# Altium schematic sheet Main.SchDoc: MoonPilot - Main
size A3; DrawnBy: Máni Magnússon; Revision: A; SheetNumber: 1
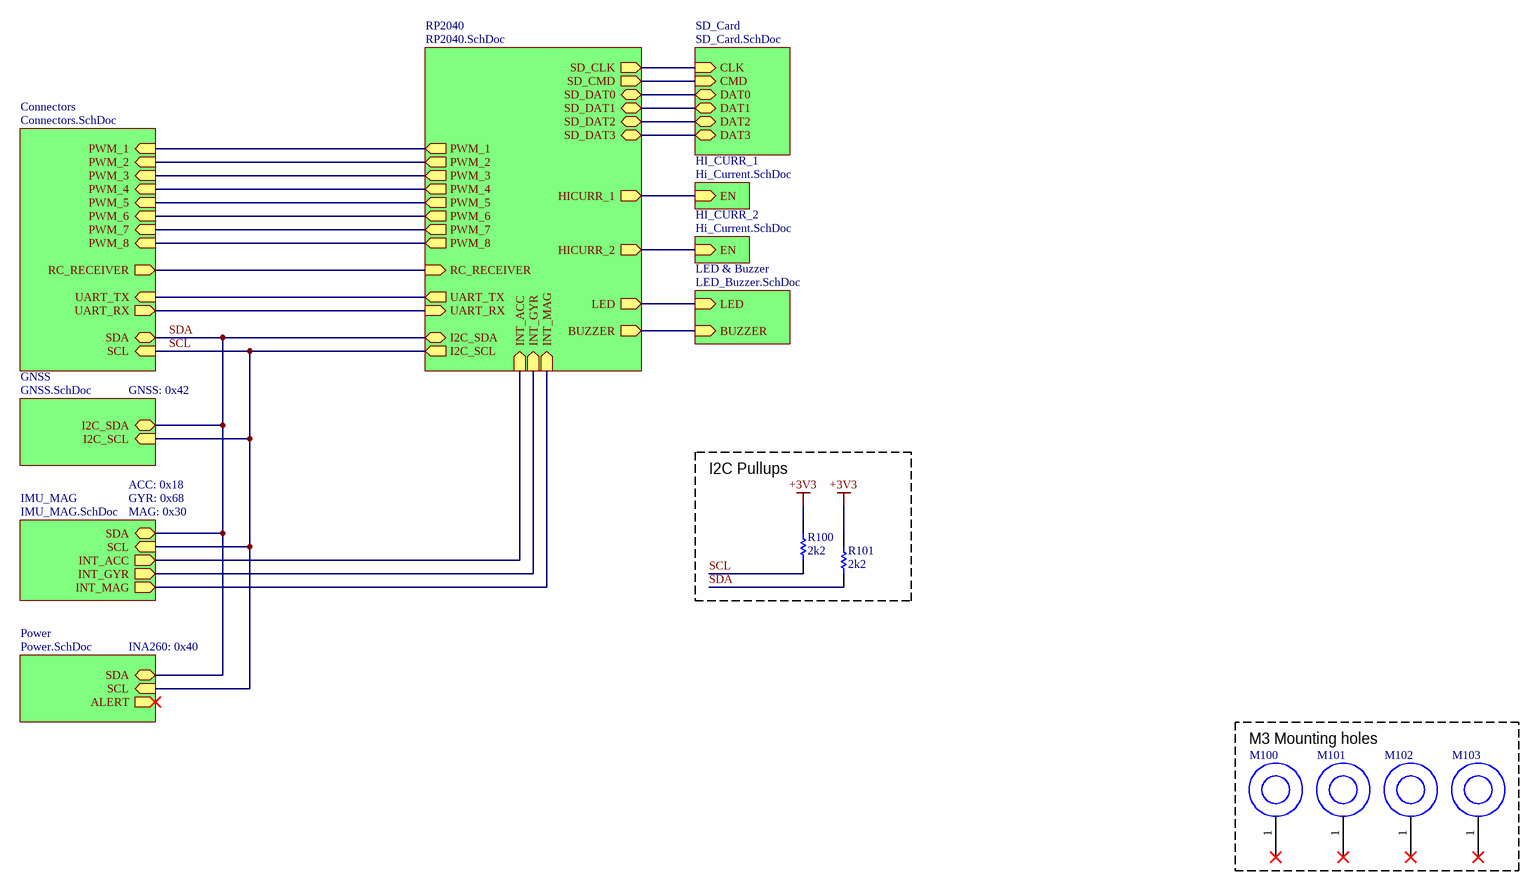
[diagram p0: Main.SchDoc]

## Parts
M100  Mounting Screw  [M3_SCREW]  (value not drawn)
M101  Mounting Screw  [M3_SCREW]  (value not drawn)
M102  Mounting Screw  [M3_SCREW]  (value not drawn)
M103  Mounting Screw  [M3_SCREW]  (value not drawn)
R100  2k2  [0603_RES]
R101  2k2  [0603_RES]

## Blocks framed on the sheet
I2C Pullups: R100 R101
M3 Mounting holes: M100-M103

## Sub-sheets
Connectors = Connectors.SchDoc: PWM_1 (in), PWM_2 (in), PWM_3 (in), PWM_4 (in), PWM_5 (in), PWM_6 (in), PWM_7 (in), PWM_8 (in), SDA (bidir), SCL (in), RC_RECEIVER (out), UART_TX (in), UART_RX (out)
GNSS = GNSS.SchDoc: I2C_SCL (in), I2C_SDA (bidir)
HI_CURR_1 = Hi_Current.SchDoc: EN (in)
HI_CURR_2 = Hi_Current.SchDoc: EN (in)
IMU_MAG = IMU_MAG.SchDoc: SDA (bidir), SCL (in), INT_ACC (out), INT_GYR (out), INT_MAG (out)
LED & Buzzer = LED_Buzzer.SchDoc: BUZZER (in), LED (in)
Power = Power.SchDoc: SCL (in), SDA (bidir), ALERT (out)
RP2040 = RP2040.SchDoc: PWM_1 (out), PWM_2 (out), PWM_3 (out), PWM_4 (out), PWM_5 (out), PWM_6 (out), PWM_7 (out), PWM_8 (out), HICURR_1 (out), HICURR_2 (out), UART_TX (out), UART_RX (in), I2C_SDA (bidir), I2C_SCL (out), SD_CLK (out), SD_CMD (out), SD_DAT0 (bidir), SD_DAT1 (bidir), SD_DAT2 (bidir), SD_DAT3 (bidir), RC_RECEIVER (in), LED (out), INT_MAG (in), INT_GYR (in), INT_ACC (in), BUZZER (out)
SD_Card = SD_Card.SchDoc: CLK (in), CMD (in), DAT0 (bidir), DAT1 (bidir), DAT2 (bidir), DAT3 (bidir)

## Nets
+3V3: R100.1 R101.1
SCL: R100.2 ; sheet RP2040/I2C_SCL, sheet GNSS/I2C_SCL, sheet IMU_MAG/SCL, sheet Power/SCL, sheet Connectors/SCL
SDA: R101.2 ; sheet RP2040/I2C_SDA, sheet GNSS/I2C_SDA, sheet IMU_MAG/SDA, sheet Power/SDA, sheet Connectors/SDA
(unnamed): sheet RP2040/PWM_1, sheet Connectors/PWM_1
(unnamed): sheet RP2040/PWM_2, sheet Connectors/PWM_2
(unnamed): sheet RP2040/PWM_3, sheet Connectors/PWM_3
(unnamed): sheet RP2040/PWM_4, sheet Connectors/PWM_4
(unnamed): sheet RP2040/PWM_5, sheet Connectors/PWM_5
(unnamed): sheet RP2040/PWM_6, sheet Connectors/PWM_6
(unnamed): sheet RP2040/PWM_7, sheet Connectors/PWM_7
(unnamed): sheet RP2040/PWM_8, sheet Connectors/PWM_8
(unnamed): sheet RP2040/HICURR_1, sheet HI_CURR_1/EN
(unnamed): sheet RP2040/HICURR_2, sheet HI_CURR_2/EN
(unnamed): sheet RP2040/UART_TX, sheet Connectors/UART_TX
(unnamed): sheet RP2040/UART_RX, sheet Connectors/UART_RX
(unnamed): sheet RP2040/SD_CLK, sheet SD_Card/CLK
(unnamed): sheet RP2040/SD_CMD, sheet SD_Card/CMD
(unnamed): sheet RP2040/SD_DAT0, sheet SD_Card/DAT0
(unnamed): sheet RP2040/SD_DAT1, sheet SD_Card/DAT1
(unnamed): sheet RP2040/SD_DAT2, sheet SD_Card/DAT2
(unnamed): sheet RP2040/SD_DAT3, sheet SD_Card/DAT3
(unnamed): sheet RP2040/RC_RECEIVER, sheet Connectors/RC_RECEIVER
(unnamed): sheet RP2040/LED, sheet LED & Buzzer/LED
(unnamed): sheet RP2040/INT_MAG, sheet IMU_MAG/INT_MAG
(unnamed): sheet RP2040/INT_GYR, sheet IMU_MAG/INT_GYR
(unnamed): sheet RP2040/INT_ACC, sheet IMU_MAG/INT_ACC
(unnamed): sheet RP2040/BUZZER, sheet LED & Buzzer/BUZZER

Not connected (* = marked no-connect by the designer): M100 1(19)*; M101 1(19)*; M102 1(19)*; M103 1(19)*

## Notes on the sheet
- GNSS: 0x42
- ACC: 0x18
- GYR: 0x68
- MAG: 0x30
- INA260: 0x40
- Sheet title:
- Revision:
- Drawn by:
- Date:
- File:

## Library data of the parts
M100-M103 = Mounting Screw: M4 and M3 scew holes, just pick the right footprint
R100 R101 = Resistor